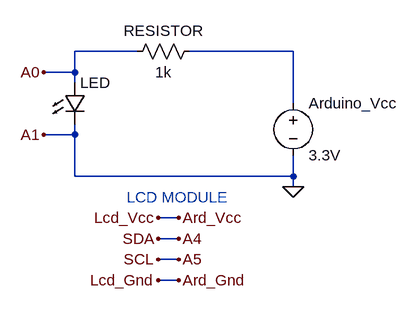
[diagram p0: schematic task_2.asc]
task_2.asc, the LTspice schematic file:
Version 4.1
SHEET 1 880 680
WIRE 144 144 48 144
WIRE 384 144 224 144
WIRE 48 176 48 144
WIRE 48 176 0 176
WIRE 48 192 48 176
WIRE 384 224 384 144
WIRE 48 272 48 256
WIRE 48 272 0 272
WIRE 48 336 48 272
WIRE 384 336 384 304
WIRE 384 336 48 336
WIRE 384 352 384 336
WIRE 208 400 176 400
WIRE 208 432 176 432
WIRE 208 464 176 464
WIRE 208 496 176 496
FLAG 384 352 0
FLAG 0 176 A0
FLAG 0 272 A1
FLAG 208 432 A4
FLAG 208 464 A5
FLAG 208 400 Ard_Vcc
FLAG 208 496 Ard_Gnd
FLAG 176 400 Lcd_Vcc
FLAG 176 496 Lcd_Gnd
FLAG 176 432 SDA
FLAG 176 464 SCL
SYMBOL voltage 384 208 R0
SYMATTR InstName Arduino_Vcc
SYMATTR Value 3.3V
SYMBOL res 240 128 R90
WINDOW 0 0 56 VBottom 2
WINDOW 3 32 56 VTop 2
SYMATTR InstName RESISTOR
SYMATTR Value 1k
SYMBOL LED 32 192 R0
SYMATTR InstName LED
SYMATTR Value ""
TEXT 128 368 Left 2 ;LCD MODULE

The netlist it stands for:
* task_2.asc
V§Arduino_Vcc N001 0 3.3V
RESISTOR N001 A0 1k
D§LED A0 0
.model D D
.lib standard.dio
* LCD MODULE
.backanno
.end